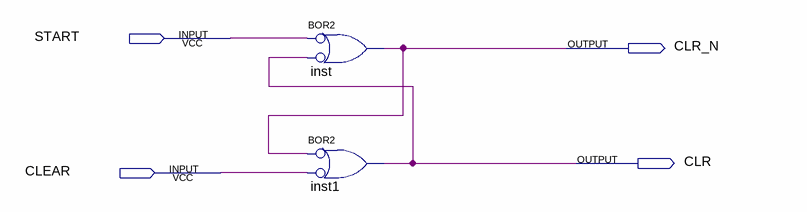
[diagram p0: schematic sheet]
// Quartus schematic CLEAR_START.bdf as structural Verilog: 2 symbols, 4 pins
module CLEAR_START (
  input  START,
  input  CLEAR,
  output CLR_N,
  output CLR
);

  or inst (CLR_N, ~START, ~CLR);  // BOR2
  or inst1 (CLR, ~CLR_N, ~CLEAR);  // BOR2
endmodule
